# EAGLE design wake_on_sleep (EAGLE 6.5.0)
AUTHOR: K. Fodor; DATABASE: C:\projects\common\EagleCad\ulp\PARTSDB.txt; PRODUCT_NAME: Wake-on-Sleep; REVISION: A.1
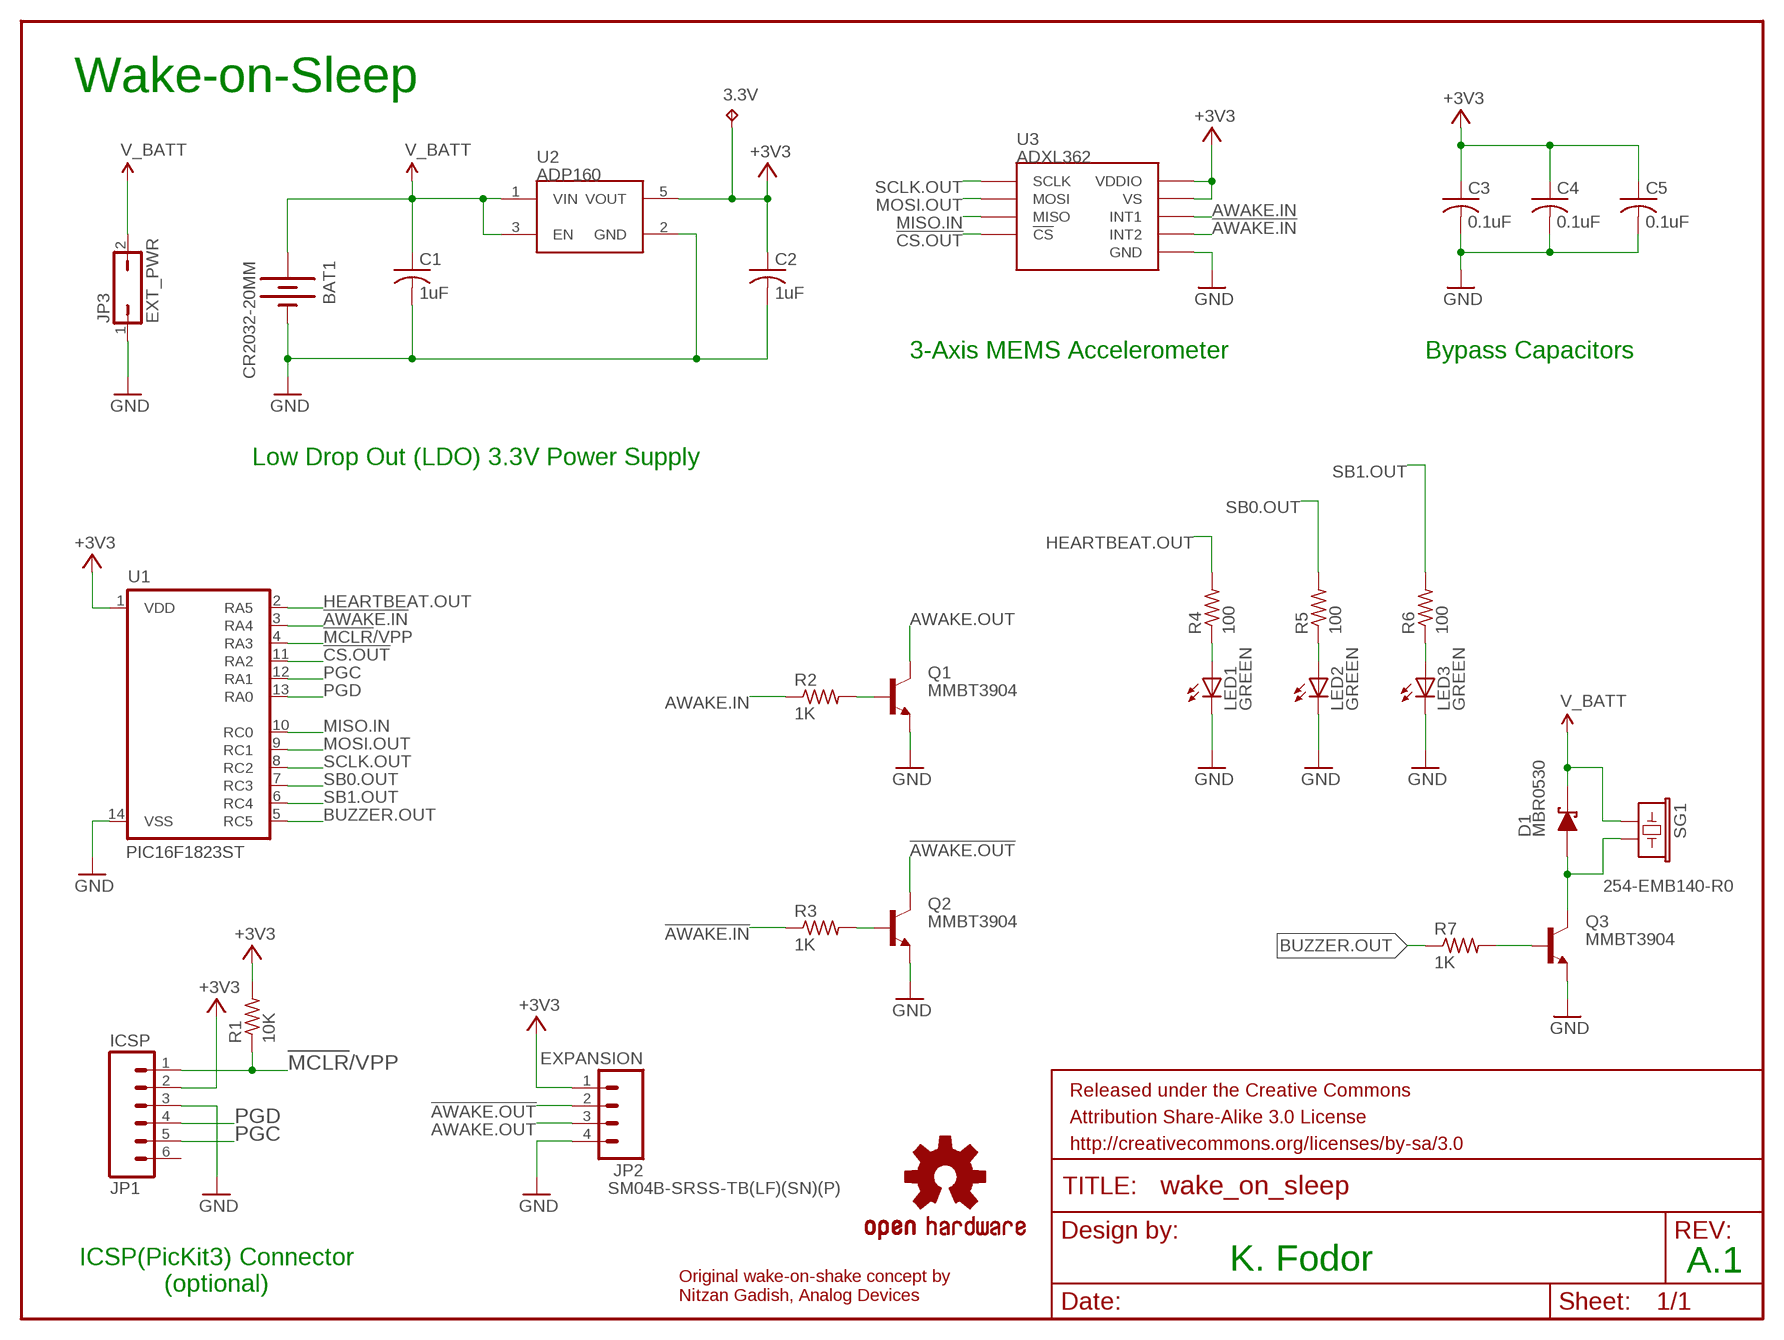
[diagram p0: schematic, sheet 1]

## Parts
3.3V  TPB2,54  [B2,54]
BAT1  CR2032-20MM  BATTERY20MM_SMD  [BATTCON_20MM_SMD_EJECT]
C1  1uF  C-USC0603  [C0603]
C2  1uF  C-USC0603  [C0603]
C3  0.1uF  C-USC0603  [C0603]
C4  0.1uF  C-USC0603  [C0603]
C5  0.1uF  C-USC0603  [C0603]
D1  MBR0530  D_SCHOTTKYK  [SOD-123]
FRAME1  FRAME-LETTER  [CREATIVE_COMMONS]
JP1  ICSP  M06SMD_MALE  [1X06_SMD_MALE]
JP2  EXPANSION  M04SMD2  [1X04-1MM-RA]
JP3  EXT_PWR  JP1Q  [JP1]
LED1  GREEN  LEDCHIPLED_0603  [CHIPLED_0603]
LED2  GREEN  LEDCHIPLED_0603  [CHIPLED_0603]
LED3  GREEN  LEDCHIPLED_0603  [CHIPLED_0603]
LOGO1  OSHW-LOGOL  [OSHW-LOGO-L]
Q1  MMBT3904  TRANSISTOR_NPNSOT23  [SOT23]
Q2  MMBT3904  TRANSISTOR_NPNSOT23  [SOT23]
Q3  MMBT3904  TRANSISTOR_NPNSOT23  [SOT23]
R1  10K  R-US_R0603R  [R0603R]
R2  1K  R-US_R0603R  [R0603R]
R3  1K  R-US_R0603R  [R0603R]
R4  100  R-US_R0603R  [R0603R]
R5  100  R-US_R0603R  [R0603R]
R6  100  R-US_R0603R  [R0603R]
R7  1K  R-US_R0603R  [R0603R]
SG1  BUZZERPTH  [BUZZER-12MM]
U1  PIC16F1823ST  [TSSOP14]
U2  ADP160  [SOT23-5]
U3  ADXL362  ADXL362EXT  [ADXL362_EXT]

## Nets
!AWAKE.IN: R3.1 U1.3(RA4) U3.P$9(INT2)
!AWAKE.OUT: JP2.2 Q2.3(C)
!CS.OUT: U1.11(RA2) U3.P$8(!CS)
!MCLR!/VPP: JP1.1 R1.1 U1.4(RA3)
+3V3: 3.3V.TP C2.1 C3.1 C4.1 C5.1 JP1.2 JP2.1 R1.2 U1.1(VDD) U2.5(VOUT) U3.P$1(VDDIO) U3.P$14(VS)
AWAKE.IN: R2.1 U3.P$11(INT1)
AWAKE.OUT: JP2.3 Q1.3(C)
BUZZER.OUT: R7.1 U1.5(RC5)
GND: BAT1.VCC@2(-) C1.2 C2.2 C3.2 C4.2 C5.2 JP1.3 JP2.4 JP3.1 LED1.C LED2.C LED3.C Q1.2(E) Q2.2(E) Q3.2(E) U1.14(VSS) U2.2(GND) U3.P$12(GND) U3.P$13(GND) U3.P$16(GND)
HEARTBEAT.OUT: R4.2 U1.2(RA5)
MISO.IN: U1.10(RC0) U3.P$7(MISO)
MOSI.OUT: U1.9(RC1) U3.P$6(MOSI)
N$2: LED3.A R6.1
N$3: LED2.A R5.1
N$4: LED1.A R4.1
N$6: Q1.1(B) R2.2
N$7: D1.A Q3.3(C) SG1.-
N$8: Q3.1(B) R7.2
N$9: Q2.1(B) R3.2
PGC: JP1.5 U1.12(RA1)
PGD: JP1.4 U1.13(RA0)
SB0.OUT: R5.2 U1.7(RC3)
SB1.OUT: R6.2 U1.6(RC4)
SCLK.OUT: U1.8(RC2) U3.P$4(SCLK)
V_BATT: BAT1.VCC@1(+) C1.1 D1.C JP3.2 SG1.+ U2.1(VIN) U2.3(EN)
Unconnected: JP1.6

## Notes on the sheet
- 3-Axis MEMS Accelerometer | Bypass Capacitors
- Low Drop Out (LDO) 3.3V Power Supply
- ICSP(PicKit3) Connector
  (optional)
- Original wake-on-shake concept by
  Nitzan Gadish, Analog Devices

## Library data of the parts
3.3V = kevin:TP: Test pad; BOM: EXCLUDE; DNP: TRUE; TP_SIGNAL_NAME: +3V3
BAT1 = kevin:BATTERY: Battery Holders Various common sizes : AA, AAA, 20mm coin cell and 12mm coin cell. 20MM_4LEGS, BATT-10373; PARTNO: BA2032SM
C1 C2 = kevin:C-US: CAPACITOR, American symbol; PARTNO: C0603C105K8RACTU
C3-C5 = kevin:C-US: CAPACITOR, American symbol; PARTNO: C0603C104M4RACTU
D1 = kevin:D_SCHOTTKY: Schottky diodes in various packages; PARTNO: MBR0530
FRAME1 = kevin:FRAME-LETTER: Schematic Frame Standard 8.5x11 US Letter frame; BOM: EXCLUDE
JP1 = kevin:M06: Header 6 Standard 6-pin 0.1" header. Use with straight break away headers (SKU : PRT-00116), right angle break away headers (PRT-00553), swiss pins (PRT-00743), machine pins (PRT-00117), and female headers (PRT-00115). Molex polarized connector foot print use with SKU : PRT-08094 with associated crimp pins and housings. NOTES ON THE VARIANTS LOCK and LOCK_LONGPADS... This footprint was designed to help hold the alignment of a through-hole component (i.e. 6-pin header) while soldering it into place. You may notice that each hole has been shifted either up or down by 0.005 of an inch from it's more standard position (which is a perfectly straight line). This slight alteration caused the pins (the squares in the middle) to touch the edges of the holes. Because they are alternating, it causes a "brace" to hold the component in place. 0.005 has proven to be the perfect amount of "off-center" position when using our standard breakaway headers. Although looks a little odd when you look at the bare footprint, once you have a header in there, the alteration is very hard to notice. Also, if you push a header all the way into place, it is covered up entirely on the bottom side. This idea of altering the position of holes to aid alignment will be further integrated into the Sparkfun Library for other footprints. It can help hold any component with 3 or more connection pins.; BOM: INCLUDE; DNP: F; PARTNO: 5-146128-4; PROD_ID: CONN-11293
JP2 = kevin:M04: Header 4 Standard 4-pin 0.1" header. Use with straight break away headers (SKU : PRT-00116), right angle break away headers (PRT-00553), swiss pins (PRT-00743), machine pins (PRT-00117), and female headers (PRT-00115). Molex polarized connector foot print use with SKU : PRT-08231 with associated crimp pins and housings.; BOM: INCLUDE; DNP: F; PARTNO: SM04B-SRSS-TB(LF)(SN)(P)
JP3 = kevin:JP1Q: JUMPER; BOM: INCLUDE; DNP: F; PARTNO: 826936-2
LED1-LED3 = kevin:LED: LED OSRAM: - CHIPLED LG R971, LG N971, LY N971, LG Q971, LY Q971, LO R971, LY R971 LH N974, LH R974 LS Q976, LO Q976, LY Q976 LO Q996 - Hyper CHIPLED LW Q18S LB Q993, LB Q99A, LB R99A - SideLED LS A670, LO A670, LY A670, LG A670, LP A670 LB A673, LV A673, LT A673, LW A673 LH A674 LY A675 LS A676, LA A676, LO A676, LY A676, LW A676 LS A679, LY A679, LG A679 - Hyper Micro SIDELED® LS Y876, LA Y876, LO Y876, LY Y876 LT Y87S - SmartLED LW L88C, LW L88S LB L89C, LB L89S, LG L890 LS L89K, LO L89K, LY L89K LS L896, LA L896, LO L896, LY L896 - TOPLED LS T670, LO T670, LY T670, LG T670, LP T670 LSG T670, LSP T670, LSY T670, LOP T670, LYG T670 LG T671, LOG T671, LSG T671 LB T673, LV T673, LT T673, LW T673 LH T674 LS T676, LA T676, LO T676, LY T676, LB T676, LH T676, LSB T676, LW T676 LB T67C, LV T67C, LT T67C, LS T67K, LO T67K, LY T67K, LW E67C LS E67B, LA E67B, LO E67B, LY E67B, LB E67C, LV E67C, LT E67C LW T67C LS T679, LY T679, LG T679 LS T770, LO T770, LY T770, LG T770, LP T770 LB T773, LV T773, LT T773, LW T773 LH T774 LS E675, LA E675, LY E675, LS T675 LS T776, LA T776, LO T776, LY T776, LB T776 LHGB T686 LT T68C, LB T68C - Hyper Mini TOPLED® LB M676 - Mini TOPLED Santana® LG M470 LS M47K, LO M47K, LY M47K Source: http://www.osram.convergy.de/; PARTNO: LTST-C191KGKT
LOGO1 = kevin:OSHW-LOGO: Open Source Hardware Logo This logo indicates the piece of hardware it is found on incorporates a OSHW license and/or adheres to the definition of open source hardware found here: http://freedomdefined.org/OSHW; BOM: EXCLUDE
Q1-Q3 = kevin:TRANSISTOR_NPN: http://www.fairchildsemi.com/ds/MM/MMBT2222.pdf; PARTNO: MMBT3904
R1 = kevin:R-US_: RESISTOR, American symbol; PARTNO: RK73H1JTTD1002F
R2 R3 R7 = kevin:R-US_: RESISTOR, American symbol; PARTNO: RK73H1JTTD1001F
R4-R6 = kevin:R-US_: RESISTOR, American symbol; PARTNO: RK73H1JTTD1000F
SG1 = kevin:BUZZER: Buzzer 12mm Spark Fun Electronics SKU : Comp-Buzzer; PARTNO: 254-EMB140-R0
U1 = kevin:PIC16F1823; PARTNO: PIC16F1823-I/ST
U2 = kevin:ADP160: Nanopower LDO Iq less than 1uA for low Iload; PARTNO: ADP160AUJZ-3.3-R7; PROD_ID: VREG-11306
U3 = kevin:ADXL362: Micropower 3-axis accelerometer 2/4/8g digital output (SPI) IC-11297; PARTNO: ADXL362BCCZ-RL

## Net classes
0 default: width 0.203 mm, clearance 0.203 mm
1 VCC: width 0.508 mm, clearance 0.203 mm

## Board
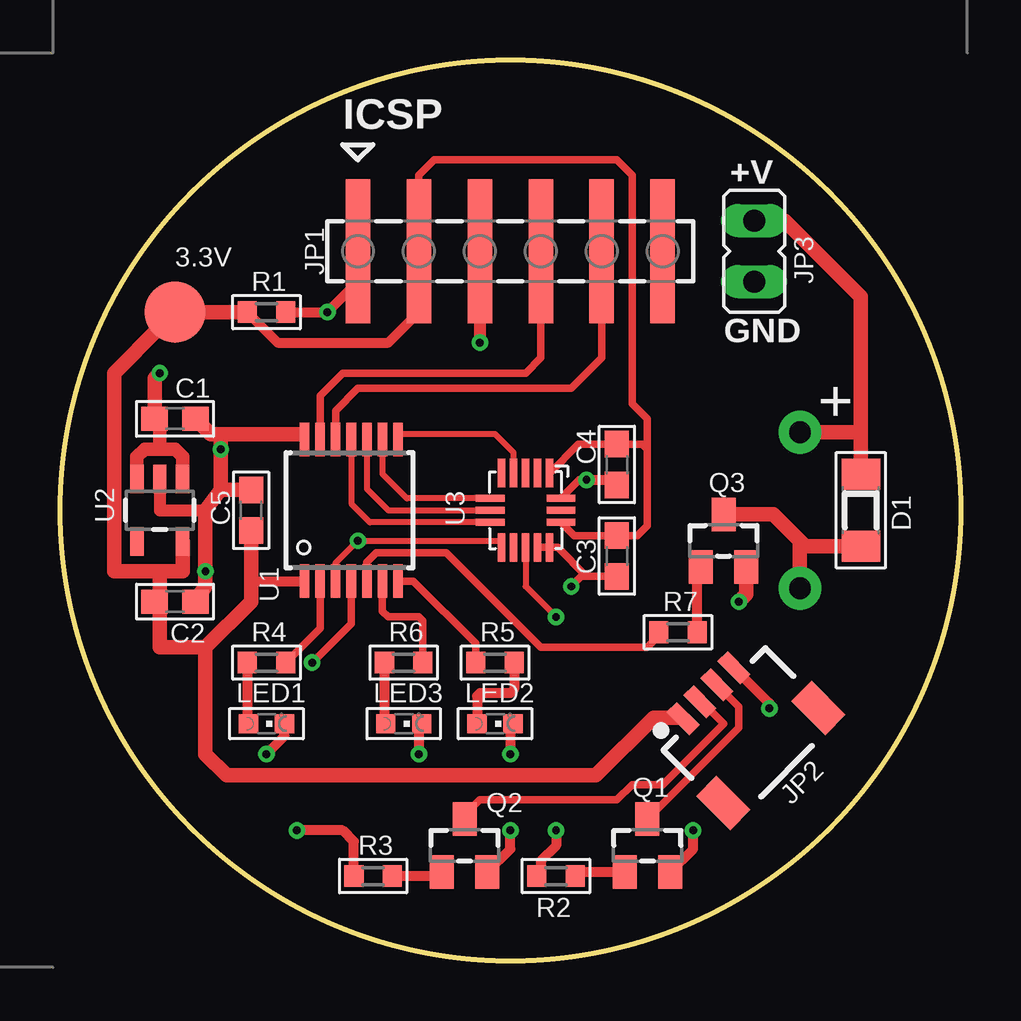
[diagram p1: board, top side]
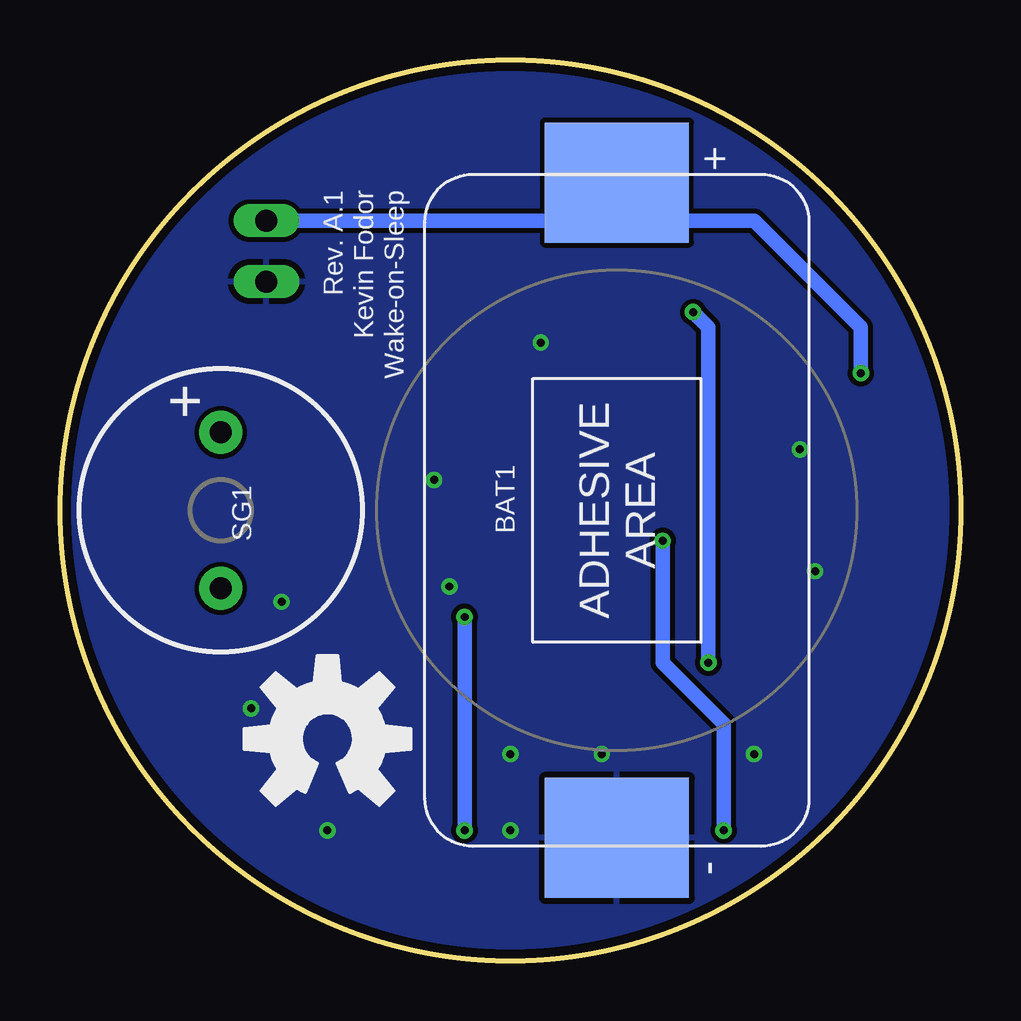
[diagram p2: board, bottom side, seen from below]

Size 37.52 x 37.52 mm. Coordinates in mm from the lower left corner, seen from the top.
Outline: circle at 18.76,18.76 radius 18.76
Copper layers (1*16): Top 0.0356mm / dielectric 1.5011mm / Bottom 0.0356mm
Design rules "LaenPCBOrder": minimum track width 6mil, minimum drill 13mil, track to track 6mil, track to pad 6mil, pad to pad 6mil, via to via 6mil, smd to smd 6mil, copper to edge 15mil, drill to drill 6mil, minimum pad ring 7mil, minimum via ring 7mil, stop-mask expansion 4mil, vias tented up to drill 0mil, thermal gap 10mil

### Footprints (pad centres in the part's own frame; a part is rotated, then mirrored left to right if it is on the bottom)
B2,54 = smd 2.54 x 2.54: TP 0,0
BATTCON_20MM_SMD_EJECT = smd 5 x 6: VCC@1 -13.65,0; VCC@2 13.65,0
C0603 = smd 1.1 x 1: 1 -0.85,0; 2 0.85,0
SOD-123 = smd 1.3 x 1.6: A -1.5,0; C 1.5,0
1X06_SMD_MALE = smd 1.02 x 6: 1 0,0; 2 2.54,0; 3 5.08,0; 4 7.62,0; 5 10.16,0; 6 12.7,0
1X04-1MM-RA = smd 0.6 x 1.35: 1 -1.5,0; 2 -0.5,0; 3 0.5,0; 4 1.5,0 | smd 1.2 x 2: NC1 2.8,-3.675; NC2 -2.8,-3.675
JP1 = drill 0.914 long: 1 0,-1.27; 2 0,1.27
CHIPLED_0603 = smd 0.8 x 0.8: A 0,-0.75; C 0,0.75
SOT23 = smd 1 x 1.4: 1 -0.95,-1.1; 2 0.95,-1.1; 3 0,1.1
R0603R = smd 0.8 x 0.9: 1 -0.8,0; 2 0.8,0
BUZZER-12MM = drill 0.9 pad 1.778: + 3.25,0; - -3.25,0
TSSOP14 = smd 0.4 x 1.4: 1 -2.225,-2.95; 2 -1.575,-2.95; 3 -0.925,-2.95; 4 -0.275,-2.95; 5 0.375,-2.95; 6 1.025,-2.95; 7 1.675,-2.95; 8 1.675,2.95; 9 1.025,2.95; 10 0.375,2.95; 11 -0.275,2.95; 12 -0.925,2.95; 13 -1.575,2.95; 14 -2.225,2.95
SOT23-5 = smd 0.55 x 1.2: 1 -0.95,-1.3; 2 0,-1.3; 3 0.95,-1.3; 4 0.95,1.3; 5 -0.95,1.3
ADXL362_EXT = smd 1.2 x 0.3: P$1 -1.55,1; P$2 -1.55,0.5; P$3 -1.55,0; P$4 -1.55,-0.5; P$5 -1.55,-1; P$9 1.55,-1; P$10 1.55,-0.5; P$11 1.55,0; P$12 1.55,0.5; P$13 1.55,1 | smd 0.3 x 1.2: P$6 -0.5,-1.475; P$7 0,-1.475; P$8 0.5,-1.475; P$14 0.5,1.475; P$15 0,1.475; P$16 -0.5,1.475

### Placement (x,y rotation side)
3.3V  4.79,27.02 180 top
BAT1  14.32,18.76 270 bottom
C1  4.79,22.57 0 top
C2  4.79,14.95 0 top
C3  23.21,16.86 270 top
C4  23.21,20.67 270 top
C5  7.97,18.76 90 top
D1  33.37,18.76 90 top
FRAME1  20.03,-7.91 0 top  (outside the outline)
JP1  12.41,29.56 0 top
JP2  27.02,11.14 45 top
JP3  28.92,29.56 0 top
LED1  8.6,9.87 270 top
LED2  18.13,9.87 270 top
LED3  14.32,9.87 270 top
LOGO1  26.38,9.24 0 bottom
Q1  24.48,4.79 0 top
Q2  16.86,4.79 0 top
Q3  27.65,17.49 0 top
R1  8.6,27.02 180 top
R2  20.67,3.52 0 top
R3  13.05,3.52 0 top
R4  8.6,12.41 0 top
R5  18.13,12.41 180 top
R6  14.32,12.41 0 top
R7  25.75,13.68 0 top
SG1  30.83,18.76 90 bottom
U1  12.41,18.76 0 top
U2  4.16,18.76 180 top
U3  19.4,18.76 270 top

### Tracks (layer width: path | path; a pad name or v marks a point on that pad's centre or on a via)
!AWAKE.IN  (via drill 0.33)
  Top 0.203: 18.32,17.49 U3.P$9
  Top 0.254: U1.3 11.49,16.57 v12.41,17.49 18.32,17.49
  Top 0.406: R3.1 12.25,4.96 11.78,5.43 v9.87,5.43
  Bottom 0.61: v9.87,5.43 9.87,9.87 12.41,12.41 v12.41,17.49
!AWAKE.OUT
  Top 0.305: Q2.3 16.86,6.06 17.49,6.7 23.21,6.7 23.84,7.33 25.11,7.33 27.65,9.87 26.74,10.79 JP2.2
!CS.OUT
  Top 0.254: U1.11 12.14,19.04 12.91,18.26 U3.P$8
!MCLR!/VPP  (via drill 0.33)
  Top 0.305: U1.4 12.14,14.04 v10.51,12.41
  Top 0.406: JP1.1 12.41,28.29 v11.14,27.02 R1.1
  Bottom 0.61: v11.14,27.02 10.51,26.38 v10.51,12.41
+3V3
  Top 0.305: C5.1 7.97,15.81 | U3.P$14 21.43,17.71 C3.1 24.06,17.71 24.48,18.13 24.48,21.3 | U3.P$1 21.6,21.52 C4.1 24.26,21.52 24.48,21.3 | 14.95,27.02 14.95,32.73 15.59,33.37 23.21,33.37 23.84,32.73 23.84,23.21 24.48,22.57 24.48,21.3
  Top 0.406: 7.97,15.81 U1.1 | R1.2 9.07,25.75 13.68,25.75 14.95,27.02 JP1.2
  Top 0.61: R1.2 3.3V.TP 4.16,26.38 2.25,24.48 2.25,16.22 4.16,16.22 | 4.16,16.22 5.11,16.22 U2.5 | C5.1 7.97,14.95 6.06,13.05 | 6.06,13.05 4.16,13.05 4.16,14.95 | 6.06,13.05 6.06,8.6 6.95,7.71 22.32,7.71 24.73,10.13 25.91,10.13 JP2.1 | C2.1 4.16,14.95 | 4.16,14.95 4.16,16.22
AWAKE.IN  (via drill 0.33)
  Top 0.254: U3.P$11 19.4,15.59 v20.67,14.32
  Top 0.406: v20.67,5.43 20.67,4.79 20.03,4.16 20.03,3.69 R2.1
  Bottom 0.61: v20.67,5.43 v20.67,14.32
AWAKE.OUT
  Top 0.305: Q1.3 28.29,9.7 28.29,10.58 JP2.3
BUZZER.OUT
  Top 0.305: U1.5 12.79,16.6 13.17,16.98 16.1,16.98 20.03,13.05 24.48,13.05 25.11,13.68 R7.1
GND  (via drill 0.33)
  Top 0.305: U3.P$12 U3.P$13 20.73,17.21 21.94,16.01 | U3.P$16 21.64,20.03 v21.94,20.03 | C3.2 21.94,16.01 | 21.94,16.01 21.72,16.01 v21.3,15.59
  Top 0.406: 9.96,21.94 U1.14 | Q2.2 18.76,4.65 v18.76,5.43 | Q1.2 26.38,4.65 v26.38,5.43 | LED3.C 14.95,9.76 v14.95,8.6 | LED2.C 18.76,9.76 v18.76,8.6 | v21.94,20.03 22.99,20.03 C4.2 | JP2.4 29.56,10.72 v29.56,10.51 | v8.6,8.6 9.35,9.35 LED1.C
  Top 0.508: U2.2 4.16,18.76 6.06,18.76 | JP1.3 v17.49,25.75
  Top 0.61: 6.7,21.94 9.96,21.94 | 6.7,19.61 6.06,18.76 v6.06,16.22 6.06,15.59 C2.2 | 6.7,19.61 v6.7,21.3 6.7,21.94 | Q3.2 28.6,15.27 v28.29,14.95 | C5.2 6.7,19.61 | C1.2 6.28,21.94 6.7,21.94
  pour Bottom: -0.29,-0.29 37.81,-0.29 37.81,37.81 -0.29,37.81
HEARTBEAT.OUT
  Top 0.305: U1.2 10.84,13.85 R4.2
MISO.IN
  Top 0.254: U1.10 12.79,19.66 13.68,18.76 U3.P$7
MOSI.OUT
  Top 0.254: U1.9 13.44,20.28 14.45,19.26 U3.P$6
N$2
  Top 0.406: R6.1 13.52,9.92
  Top 0.61: 13.52,9.92 LED3.A
N$3
  Top 0.406: R5.1 18.93,11.31 18.76,11.14 17.49,11.14 17.38,11.03 LED2.A
N$4
  Top 0.203: 7.8,9.92 LED1.A
  Top 0.406: R4.1 7.8,9.92
N$6
  Top 0.406: R2.2 21.64,3.69 Q1.1
N$7
  Top 0.61: Q3.3 29.73,18.59 30.83,17.49 | 30.83,17.49 SG1.- | D1.A 31.06,17.26 30.83,17.49
N$8
  Top 0.305: 26.55,16.24 Q3.1
  Top 0.406: R7.2 26.55,16.24
N$9
  Top 0.406: Q2.1 15.74,3.52 R3.2
PGC
  Top 0.305: U1.12 11.49,22.92 12.41,23.84 21.3,23.84 22.57,25.11 JP1.5
PGD
  Top 0.305: U1.13 10.84,23.54 11.78,24.48 19.4,24.48 20.03,25.11 JP1.4
SB0.OUT
  Top 0.305: U1.7 14.73,15.81 17.33,13.21 R5.2
SB1.OUT
  Top 0.305: U1.6 13.44,14.56 13.68,14.32 14.95,14.32 15.12,14.15 R6.2
SCLK.OUT
  Top 0.254: U3.P$4 18.9,21.17 18.13,21.94 14.06,21.94 14.06,21.74 U1.8
V_BATT  (via drill 0.33)
  Top 0.406: C1.1 4.16,22.36
  Top 0.559: U2.3 3.21,20.99 3.52,21.3 4.16,21.3 | 4.16,21.3 4.79,21.3 5.11,20.99 U2.1 | 4.16,22.36 4.16,21.3
  Top 0.61: JP3.2 30.19,30.83 33.37,27.65 33.37,21.94 | D1.C 33.37,21.94 | SG1.+ 33.29,22.01 33.37,21.94 | C1.1 3.94,24.26 v4.16,24.48
  Bottom 0.61: JP3.2 14.32,30.83 | BAT1.VCC@1 14.32,30.83 | 14.32,30.83 8.6,30.83 4.16,26.38 v4.16,24.48

### Text on the board
tPlace: ICSP | +V | GND
bPlace: Wake-on-Sleep | Kevin Fodor | Rev. A.1